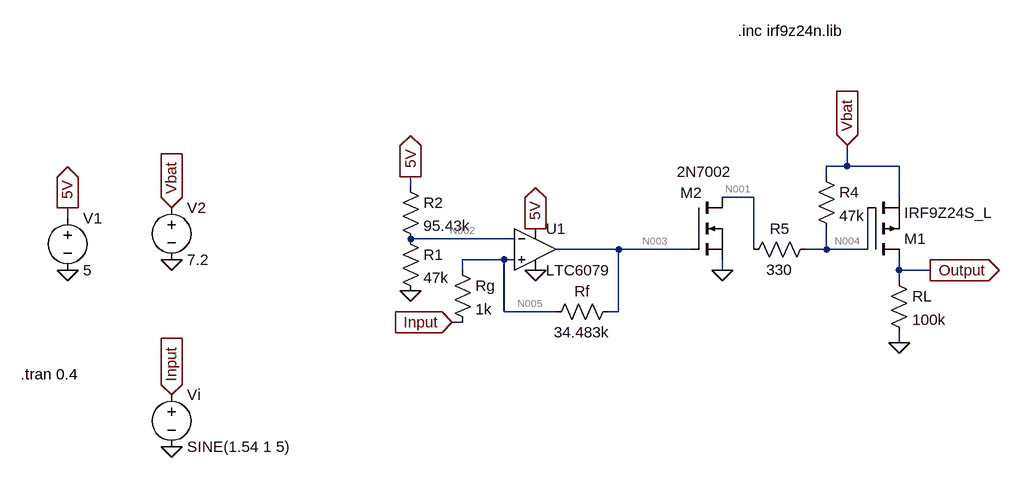
[diagram p0: schematic E344_UnderVoltageProtection.asc]
E344_UnderVoltageProtection.asc, the LTspice schematic file:
Version 4
SHEET 1 2256 680
WIRE 688 32 688 0
WIRE 688 32 656 32
WIRE 768 32 688 32
WIRE 656 48 656 32
WIRE 16 64 16 48
WIRE 544 80 496 80
WIRE 768 80 768 32
WIRE -512 112 -512 96
WIRE 176 144 16 144
WIRE 336 160 240 160
WIRE 448 160 336 160
WIRE 544 160 544 80
WIRE 656 160 656 128
WIRE 656 160 624 160
WIRE 720 160 720 96
WIRE 720 160 656 160
WIRE 160 176 96 176
WIRE 176 176 160 176
WIRE 96 192 96 176
WIRE 496 192 496 176
WIRE 768 192 768 176
WIRE 816 192 768 192
WIRE 768 208 768 192
WIRE 160 256 160 176
WIRE 240 256 160 256
WIRE 336 256 336 160
WIRE 336 256 320 256
WIRE 96 272 80 272
WIRE 768 304 768 288
FLAG 208 192 0
FLAG -512 192 0
FLAG -512 96 5V
IOPIN -512 96 Out
FLAG 16 224 0
FLAG 16 48 5V
IOPIN 16 48 Out
FLAG 80 272 Input
IOPIN 80 272 In
FLAG -352 384 Input
IOPIN -352 384 In
FLAG -352 464 0
FLAG 816 192 Output
IOPIN 816 192 Out
FLAG -352 176 0
FLAG -352 96 Vbat
IOPIN -352 96 In
FLAG 768 304 0
FLAG 208 128 5V
IOPIN 208 128 Out
FLAG 496 192 0
FLAG 688 0 Vbat
IOPIN 688 0 In
SYMBOL voltage -512 96 R0
WINDOW 123 0 0 Left 0
WINDOW 39 0 0 Left 0
SYMATTR InstName V1
SYMATTR Value 5
SYMBOL OpAmps\\LTC6079 208 160 R0
SYMATTR InstName U1
SYMBOL res 0 128 R0
SYMATTR InstName R1
SYMATTR Value 47k
SYMBOL res 0 48 R0
SYMATTR InstName R2
SYMATTR Value 95.43k
SYMBOL res 336 240 R90
WINDOW 0 0 56 VBottom 2
WINDOW 3 32 56 VTop 2
SYMATTR InstName Rf
SYMATTR Value 34.483k
SYMBOL res 80 176 R0
SYMATTR InstName Rg
SYMATTR Value 1k
SYMBOL voltage -352 368 R0
WINDOW 123 0 0 Left 0
WINDOW 39 0 0 Left 0
SYMATTR InstName Vi
SYMATTR Value SINE(1.54 1 5)
SYMBOL voltage -352 80 R0
WINDOW 123 0 0 Left 0
WINDOW 39 0 0 Left 0
SYMATTR InstName V2
SYMATTR Value 7.2
SYMBOL pmos 720 176 M180
SYMATTR InstName M1
SYMATTR Value IRF9Z24S_L
SYMBOL res 752 192 R0
SYMATTR InstName RL
SYMATTR Value 100k
SYMBOL nmos 448 80 R0
WINDOW 0 -17 -7 Left 2
WINDOW 3 -22 -39 Left 2
SYMATTR InstName M2
SYMATTR Value 2N7002
SYMBOL res 640 32 R0
SYMATTR InstName R4
SYMATTR Value 47k
SYMBOL res 640 144 R90
WINDOW 0 0 56 VBottom 2
WINDOW 3 32 56 VTop 2
SYMATTR InstName R5
SYMATTR Value 330
TEXT -584 352 Left 2 !.tran 0.4
TEXT 520 -176 Left 2 !.inc irf9z24n.lib

The netlist it stands for:
* E344_UnderVoltageProtection.asc
V1 5V 0 5
XU1 N005 N002 5V 0 N003 LTC6078  ; LTC6079, pins In+ In- V+ V- OUT
R1 N002 0 47k
R2 5V N002 95.43k
Rf N003 N005 34.483k
Rg N005 Input 1k
Vi Input 0 SINE(1.54 1 5)
V2 Vbat 0 7.2
M1 Output N004 Vbat Vbat IRF9Z24S_L
RL Output 0 100k
M2 N001 N003 0 0 2N7002
R4 Vbat N004 47k
R5 N004 N001 330
.model NMOS NMOS
.model PMOS PMOS
.lib standard.mos
.tran 0.4
.inc irf9z24n.lib
.lib LTC5.lib
.backanno
.end

* Results of the author's LTspice run, read from the files saved beside the schematic
* Operating Point, zero values left out:
*   V(5v) = 5 V
*   V(n005) = 1.497 V
*   V(n002) = 1.65 V
*   V(n003) = 2.323 mV
*   V(input) = 1.54 V
*   V(vbat) = 7.2 V
*   V(output) = 5.24 µV
*   V(n004) = 7.2 V
*   V(n001) = 7.2 V
*   Id(M2) = 7.232 pA
*   Is(M2) = -7.232 pA
*   Id(M1) = -45.2 pA
*   Is(M1) = 45.2 pA
*   I(R5) = 14.43 pA
*   I(R4) = 14.43 pA
*   I(Rl) = 52.4 pA
*   I(Rg) = -43.34 µA
*   I(Rf) = -43.34 µA
*   I(R2) = 35.1 µA
*   I(R1) = 35.1 µA
*   I(V2) = -66.83 pA
*   I(Vi) = -43.34 µA
*   I(V1) = -71.14 µA
*   Ix(u1:3) = 36.04 µA
*   Ix(u1:4) = -79.37 µA
*   Ix(u1:5) = 43.34 µA
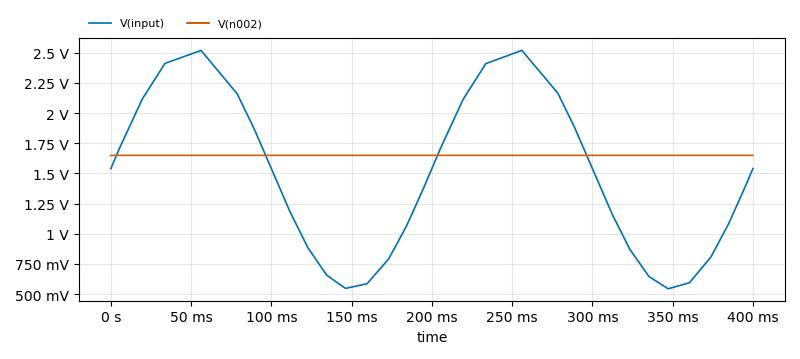
[diagram p1: Transient Analysis of E344_UnderVoltageProtection.asc, plotted from the saved traces]
* Transient Analysis, 1 run:
*   V(input): min 543.8 mV, max 2.52 V, average 1.534 V, rms 1.685 V, last 1.54 V
*   V(n002): min 1.65 V, max 1.65 V, average 1.65 V, rms 1.65 V, last 1.65 V